# EAGLE design tb_target (EAGLE 6.2)
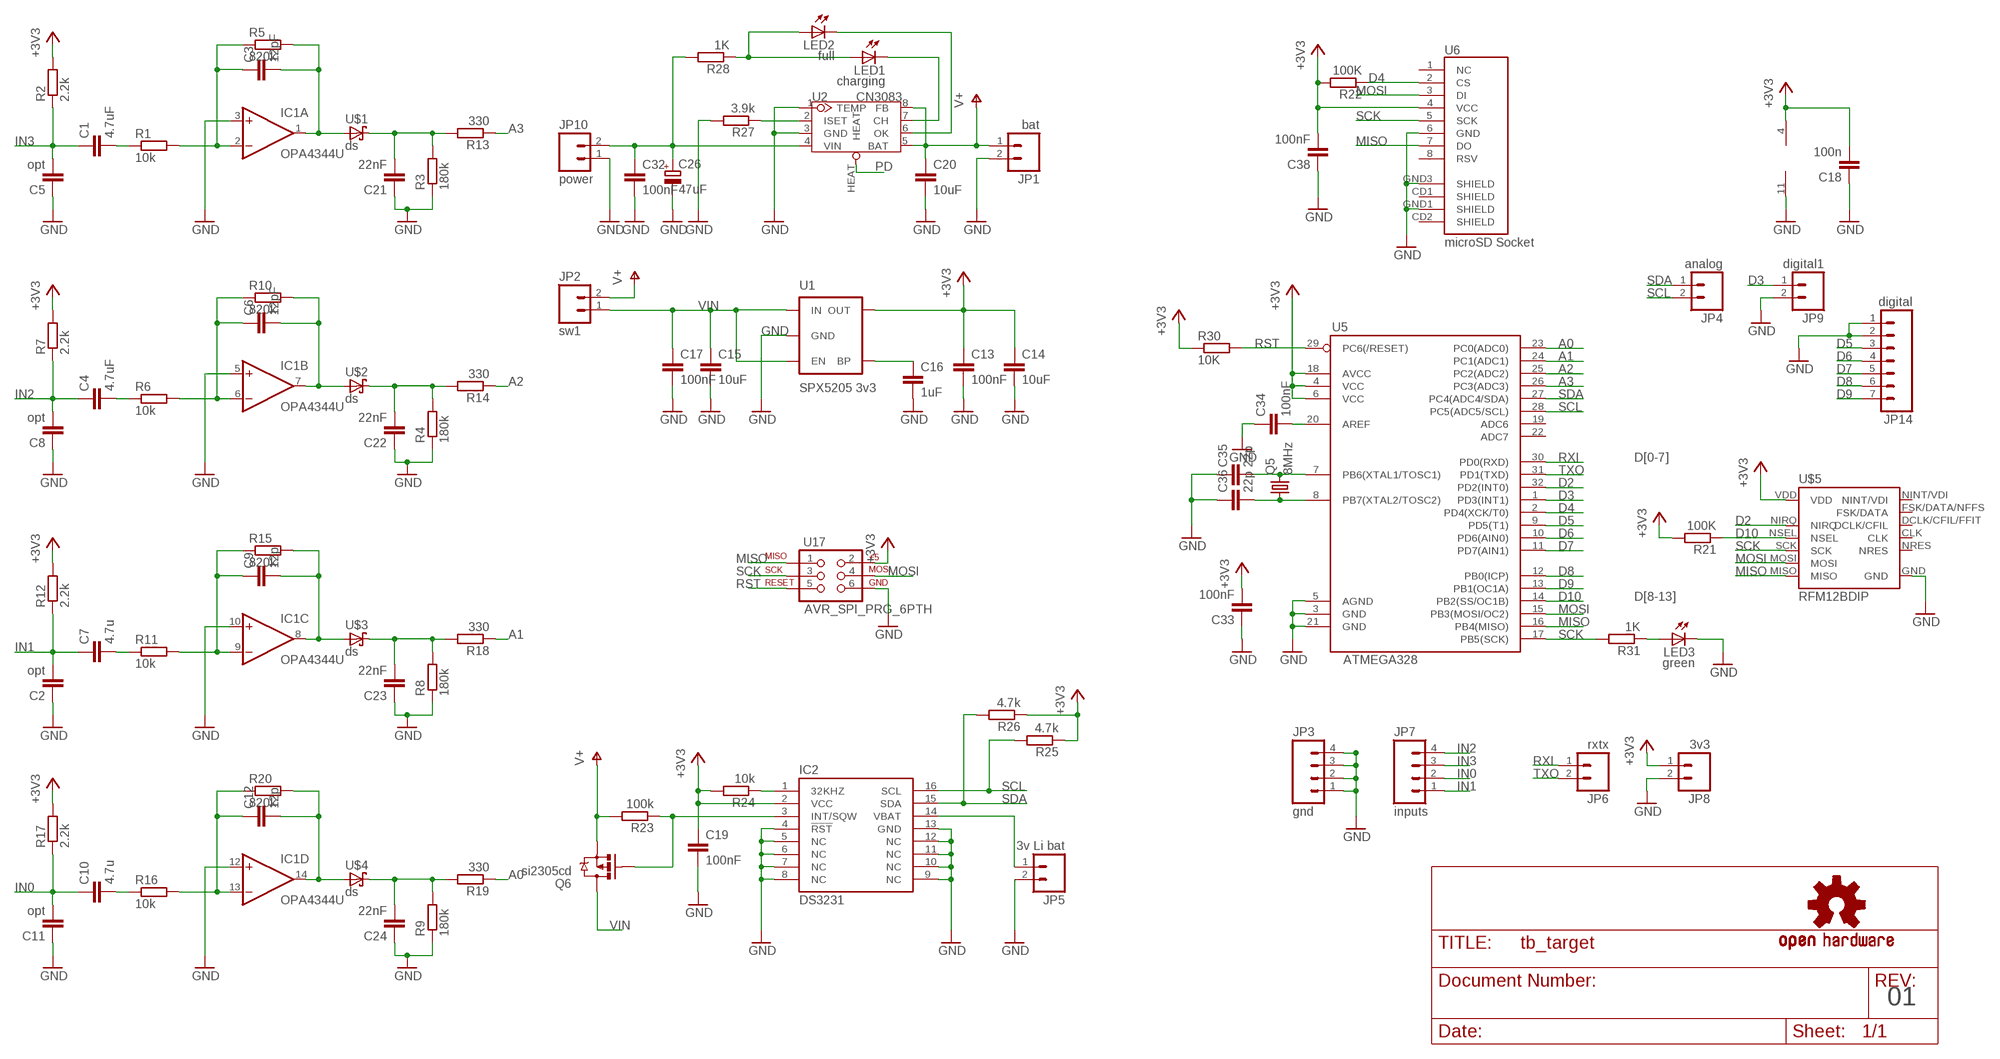
[diagram p0: schematic, sheet 1]

## Parts
C1  4.7uF  C-EUC0805  [C0805]
C2  opt  C-EUC0805  [C0805]
C3  12pF  C-EUC0805  [C0805]
C4  4.7uF  C-EUC0805  [C0805]
C5  opt  C-EUC0805  [C0805]
C6  12pF  C-EUC0805  [C0805]
C7  4.7u  C-EUC0805  [C0805]
C8  opt  C-EUC0805  [C0805]
C9  12p  C-EUC0805  [C0805]
C10  4.7u  C-EUC0805  [C0805]
C11  opt  C-EUC0805  [C0805]
C12  12p  C-EUC0805  [C0805]
C13  100nF  C-EUC0805  [C0805]
C14  10uF  C-EUC1206  [C1206]
C15  10uF  C-EUC1206  [C1206]
C16  1uF  C-EUC0805  [C0805]
C17  100nF  C-EUC0805  [C0805]
C18  100n  C-EUC0805  [C0805]
C19  100nF  C-EUC0805  [C0805]
C20  10uF  C-EUC1206  [C1206]
C21  22nF  C-EUC0805  [C0805]
C22  22nF  C-EUC0805  [C0805]
C23  22nF  C-EUC0805  [C0805]
C24  22nF  C-EUC0805  [C0805]
C26  47uF  CPOL-EUCT7343  [CT7343]
C32  100nF  C-EUC0805  [C0805]
C33  100nF  C-EUC0805  [C0805]
C34  100nF  C-EUC0805  [C0805]
C35  22p  C-EUC0805  [C0805]
C36  22p  C-EUC0805  [C0805]
C38  100nF  C-EUC0805  [C0805]
IC1  OPA4344U  [SO14]
IC2  DS3231  [SO-16]
JP1  bat  M02PTH  [1X02]
JP2  sw1  M02PTH  [1X02]
JP3  gnd  M04PTH  [1X04]
JP4  analog  M02PTH  [1X02]
JP5  3v Li bat  M02PTH  [1X02]
JP6  rxtx  M02PTH  [1X02]
JP7  inputs  M04PTH  [1X04]
JP8  3v3  M02PTH  [1X02]
JP9  digital1  M02PTH  [1X02]
JP10  power  M02PTH  [1X02]
JP14  digital  M07  [1X07]
LED1  charging  LEDCHIP-LED0805  [CHIP-LED0805]
LED2  full  LEDCHIP-LED0805  [CHIP-LED0805]
LED3  green  LEDCHIP-LED0805  [CHIP-LED0805]
Q5  8MHz  CRYTAL  [CRYSTAL_5X3.2]
Q6  si2305cd  MOSFET-PCHANNELSMD_POWER  [SOT23-3_POWER]
R1  10k  R-EU_R0805W  [R0805W]
R2  2.2k  R-EU_R0805W  [R0805W]
R3  180k  R-EU_R0805W  [R0805W]
R4  180k  R-EU_R0805W  [R0805W]
R5  820k  R-EU_R0805W  [R0805W]
R6  10k  R-EU_R0805W  [R0805W]
R7  2.2k  R-EU_R0805W  [R0805W]
R8  180k  R-EU_R0805W  [R0805W]
R9  180k  R-EU_R0805W  [R0805W]
R10  820k  R-EU_R0805W  [R0805W]
R11  10k  R-EU_R0805W  [R0805W]
R12  2.2k  R-EU_R0805W  [R0805W]
R13  330  R-EU_R0805W  [R0805W]
R14  330  R-EU_R0805W  [R0805W]
R15  820k  R-EU_R0805W  [R0805W]
R16  10k  R-EU_R0805W  [R0805W]
R17  2.2k  R-EU_R0805W  [R0805W]
R18  330  R-EU_R0805W  [R0805W]
R19  330  R-EU_R0805W  [R0805W]
R20  820k  R-EU_R0805W  [R0805W]
R21  100K  R-EU_R0805W  [R0805W]
R22  100K  R-EU_R0805W  [R0805W]
R23  100k  R-EU_R0805W  [R0805W]
R24  10k  R-EU_R0805W  [R0805W]
R25  4.7k  R-EU_R0805W  [R0805W]
R26  4.7k  R-EU_R0805W  [R0805W]
R27  3.9k  R-EU_R0805W  [R0805W]
R28  1K  R-EU_R0805W  [R0805W]
R30  10K  R-EU_R0805W  [R0805W]
R31  1K  R-EU_R0805W  [R0805W]
U1  SPX5205 3v3  V_REG_LDOSMD  [SOT23-5]
U2  CN3083  [SOP8-W/-HEAT]
U5  ATMEGA328  ATMEGA168  [TQFP32-08]
U6  microSD Socket  USD-SOCKETNEW  [MICRO-SD-SOCKET-PP]
U17  AVR_SPI_PRG_6PTH  [2X3]
U$1  ds  DIODE-SCHOTTKYMINIMELF  [SOD80]
U$2  ds  DIODE-SCHOTTKYMINIMELF  [SOD80]
U$3  ds  DIODE-SCHOTTKYMINIMELF  [SOD80]
U$4  ds  DIODE-SCHOTTKYMINIMELF  [SOD80]
U$5  RFM12BDIP  [RFM12B_DIP]
U$7  OSHW-LOGOM  [OSHW-LOGO-M]

## Nets
+3V3: C13.1 C14.1 C18.2 C19.1 C33.2 C38.2 IC1.4(P:V+) IC2.2(VCC) JP8.1 R2.2 R7.2 R12.2 R17.2 R21.2 R22.2 R24.2 R25.1 R26.1 R30.1 U1.5(OUT) U5.4(VCC) U5.6(VCC) U5.18(AVCC) U6.4(VCC) U17.2 U$5.VDD
A0: R19.1 U5.23(PC0(ADC0))
A0D: C24.2 R9.2 R19.2 U$4.C
A1: R18.1 U5.24(PC1(ADC1))
A1D: C23.2 R8.2 R18.2 U$3.C
A2: R14.1 U5.25(PC2(ADC2))
A2D: C22.2 R4.2 R14.2 U$2.C
A2E: C6.2 IC1.7(B:OUT) R10.2 U$2.A
A3: R13.1 U5.26(PC3(ADC3))
A3D: C21.2 R3.2 R13.2 U$1.C
D2: U5.32(PD2(INT0)) U$5.NIRQ
D3: JP9.1 U5.1(PD3(INT1))
D4: R22.1 U5.2(PD4(XCK/T0)) U6.2(CS)
D5: JP14.3 U5.9(PD5(T1))
D6: JP14.4 U5.10(PD6(AIN0))
D7: JP14.5 U5.11(PD7(AIN1))
D8: JP14.6 U5.12(PB0(ICP))
D9: JP14.7 U5.13(PB1(OC1A))
D10: R21.1 U5.14(PB2(SS/OC1B)) U$5.NSEL
GND: C2.1 C5.1 C8.1 C11.1 C13.2 C14.2 C15.2 C16.2 C17.2 C18.1 C19.2 C20.2 C21.1 C22.1 C23.1 C24.1 C26.- C32.2 C33.1 C34.1 C35.1 C36.1 C38.1 IC1.3(A:+IN) IC1.5(B:+IN) IC1.10(C:+IN) IC1.11(P:V-) IC1.12(D:+IN) IC2.4(!RST) IC2.5(NC) IC2.6(NC) IC2.7(NC) IC2.8(NC) IC2.9(NC) IC2.10(NC) IC2.11(NC) IC2.12(NC) IC2.13(GND) JP1.2 JP3.1 JP3.2 JP3.3 JP3.4 JP5.2 JP8.2 JP9.2 JP10.1 JP14.1 JP14.2 LED3.C R3.1 R4.1 R8.1 R9.1 R27.2 U1.2(GND) U2.1(TEMP) U2.3(GND) U5.3(GND) U5.5(AGND) U5.21(GND) U6.6(GND) U6.GND1(SHIELD) U6.GND3(SHIELD) U17.6 U$5.GND
IN0: C10.1 C11.2 JP7.2 R17.1
IN1: C2.2 C7.1 JP7.1 R12.1
IN2: C4.1 C8.2 JP7.4 R7.1
IN3: C1.1 C5.2 JP7.3 R2.1
MISO: U5.16(PB4(MISO)) U6.7(DO) U17.1 U$5.MISO
MOSI: U5.15(PB3(MOSI/OC2)) U6.3(DI) U17.4 U$5.MOSI
N$1: C16.1 U1.4(BP)
N$2: C1.2 R1.1
N$3: C3.1 IC1.2(A:-IN) R1.2 R5.1
N$4: IC2.1(32KHZ) R24.1
N$6: IC2.3(INT/SQW) Q6.1(G) R23.1
N$7: C4.2 R6.1
N$8: C6.1 IC1.6(B:-IN) R6.2 R10.1
N$10: IC2.14(VBAT) JP5.1
N$11: R27.1 U2.2(ISET)
N$12: C7.2 R11.1
N$13: C9.1 IC1.9(C:-IN) R11.2 R15.1
N$15: C26.+ C32.1 JP10.2 R28.2 U2.4(VIN)
N$16: LED1.A LED2.A R28.1
N$17: C10.2 R16.1
N$18: C12.1 IC1.13(D:-IN) R16.2 R20.1
N$20: LED1.C U2.7(CH)
N$21: LED2.C U2.6(OK)
N$26: C36.2 Q5.P$1 U5.8(PB7(XTAL2/TOSC2))
N$27: C35.2 Q5.P$2 U5.7(PB6(XTAL1/TOSC1))
N$28: C34.2 U5.20(AREF)
N$34: LED3.A R31.1
N$88: C3.2 IC1.1(A:OUT) R5.2 U$1.A
N$90: C9.2 IC1.8(C:OUT) R15.2 U$3.A
N$91: C12.2 IC1.14(D:OUT) R20.2 U$4.A
PD: U2.HEAT
RST: R30.2 U5.29(PC6(/RESET)) U17.5
RXI: JP6.1 U5.30(PD0(RXD))
SCK: R31.2 U5.17(PB5(SCK)) U6.5(SCK) U17.3 U$5.SCK
SCL: IC2.16(SCL) JP4.2 R25.2 U5.28(PC5(ADC5/SCL))
SDA: IC2.15(SDA) JP4.1 R26.2 U5.27(PC4(ADC4/SDA))
TXO: JP6.2 U5.31(PD1(TXD))
V+: C20.1 JP1.1 JP2.2 Q6.2(S) R23.2 U2.5(BAT) U2.8(FB)
VIN: C15.1 C17.1 JP2.1 Q6.3(D) U1.1(IN) U1.3(EN)
Unconnected: U5.19(ADC6) U5.22(ADC7) U6.1(NC) U6.8(RSV) U6.CD1(SHIELD) U6.CD2(SHIELD) U$5.CLK U$5.DCLK/CFIL/FFIT(DCLK/CFIL) U$5.FSK/DATA/NFFS(FSK/DATA) U$5.NINT/VDI U$5.NRES

## Notes on the sheet
- D[0-7]
- D[8-13]
- 01

## Library data of the parts
C1-C12 C18 C21-C24 = resistor:C-EU: CAPACITOR, European symbol
C13-C17 C19 C20 C32-C36 C38 = rcl:C-EU: CAPACITOR, European symbol
C26 = rcl:CPOL-EU: POLARIZED CAPACITOR, European symbol
IC1 = linear:OPA4*: Quad Operational Amplifier compatible with: TLC27L4 Low Power, Single-Supply, Rail-To-Rail Operational Amplifier Source: http://focus.ti.com/lit/ds/symlink/opa2345.pdf http://focus.ti.com .. opa241.pdf http://focus.ti.com .. tlc27l4.pdf http://focus.ti.com/lit/ds/symlink/opa2134.pdf
IC2 = ds3231:DS3231: DS3231 RTC
JP1 JP2 JP4-JP6 JP8-JP10 = SparkFun:M02: Header 2 Standard 2-pin 0.1" header. Use with straight break away headers (SKU : PRT-00116), right angle break away headers (PRT-00553), swiss pins (PRT-00743), machine pins (PRT-00117), and female headers (PRT-00115). Molex polarized connector foot print use with SKU : PRT-08233 with associated crimp pins and housings.
JP3 JP7 = SparkFun:M04: Header 4 Standard 4-pin 0.1" header. Use with straight break away headers (SKU : PRT-00116), right angle break away headers (PRT-00553), swiss pins (PRT-00743), machine pins (PRT-00117), and female headers (PRT-00115). Molex polarized connector foot print use with SKU : PRT-08231 with associated crimp pins and housings. 1MM SMD Version SKU: PRT-10208
JP14 = SparkFun-Connectors:M07: Header 7 Standard 7-pin 0.1" header. Use with straight break away headers (SKU : PRT-00116), right angle break away headers (PRT-00553), swiss pins (PRT-00743), machine pins (PRT-00117), and female headers (PRT-00115). NOTES ON THE VARIANTS LOCK and LOCK_LONGPADS... This footprint was designed to help hold the alignment of a through-hole component (i.e. 7-pin header) while soldering it into place. You may notice that each hole has been shifted either up or down by 0.005 of an inch from it's more standard position (which is usually a perfectly straight line). This slight alteration caused the pins (the squares in the middle) to touch the edges of the holes. Because they are alternating, it causes a "brace" to hold the header in place. 0.005 has proven to be the perfect amount of "off-center" position when using our standard breakaway headers. Although looks a little odd when you look at the bare footprint, once you have a header in there, the alteration is very hard to notice. Also, if you push a header all the way into place, it is covered up entirely on the bottom side. This idea of altering the position of holes to aid alignment will be further integrated into the Sparkfun Library for other footprints. It can help hold any component with 3 or more connection pins.
LED1-LED3 = led:LED: LED OSRAM: - CHIPLED LG R971, LG N971, LY N971, LG Q971, LY Q971, LO R971, LY R971 LH N974, LH R974 LS Q976, LO Q976, LY Q976 LO Q996 - Hyper CHIPLED LW Q18S LB Q993, LB Q99A, LB R99A - SideLED LS A670, LO A670, LY A670, LG A670, LP A670 LB A673, LV A673, LT A673, LW A673 LH A674 LY A675 LS A676, LA A676, LO A676, LY A676, LW A676 LS A679, LY A679, LG A679 - Hyper Micro SIDELED® LS Y876, LA Y876, LO Y876, LY Y876 LT Y87S - SmartLED LW L88C, LW L88S LB L89C, LB L89S, LG L890 LS L89K, LO L89K, LY L89K LS L896, LA L896, LO L896, LY L896 - TOPLED LS T670, LO T670, LY T670, LG T670, LP T670 LSG T670, LSP T670, LSY T670, LOP T670, LYG T670 LG T671, LOG T671, LSG T671 LB T673, LV T673, LT T673, LW T673 LH T674 LS T676, LA T676, LO T676, LY T676, LB T676, LH T676, LSB T676, LW T676 LB T67C, LV T67C, LT T67C, LS T67K, LO T67K, LY T67K, LW E67C LS E67B, LA E67B, LO E67B, LY E67B, LB E67C, LV E67C, LT E67C LW T67C LS T679, LY T679, LG T679 LS T770, LO T770, LY T770, LG T770, LP T770 LB T773, LV T773, LT T773, LW T773 LH T774 LS E675, LA E675, LY E675, LS T675 LS T776, LA T776, LO T776, LY T776, LB T776 LHGB T686 LT T68C, LB T68C - Hyper Mini TOPLED® LB M676 - Mini TOPLED Santana® LG M470 LS M47K, LO M47K, LY M47K Source: http://www.osram.convergy.de/
Q5 = Omat_komponentit:CRYTAL: CRYSTAL
Q6 = Simplex-DiscreteSemi:MOSFET-PCHANNEL: Generic PMOSFET
R1-R20 = resistor:R-EU_: RESISTOR, European symbol
R21-R28 R30 R31 = rcl:R-EU_: RESISTOR, European symbol
U1 = SparkFun:V_REG_LDO: Voltage Regulator LDO Standard 150mA LDO voltage regulator in SOT-23 layout. Micrel part MIC5205. BP (by-pass) pin is used to lower output noise with 470pF cap.
U2 = IC:CN3083
U5 = SparkFun:ATMEGA168
U6 = SparkFun:USD-SOCKET: microSD Socket Push-push type uSD socket. Schematic element and footprint production proven. Spark Fun Electronics SKU : PRT-00127. tDoc lines correctly indicate media card edge positions when inserting (unlocked, locked, depressed).
U17 = SparkFun:AVR_SPI_PRG_6: AVR ISP 6 Pin This is the reduced ISP connector for AVR programming. Common on Arduino. This footprint will take up less PCB space and can be used with a 10-pin to 6-pin adapter such as SKU: BOB-08508
U$1-U$4 = Simplex-DiscreteSemi:DIODE-SCHOTTKY: diode-schottky
U$5 = Simplex-ICs:RFM12B: RFM12B HopeRF FSK tranceiver
U$7 = SparkFun:OSHW-LOGO: Open Source Hardware Logo This logo indicates the piece of hardware it is found on incorporates a OSHW license and/or adheres to the definition of open source hardware found here: http://freedomdefined.org/OSHW

## Board
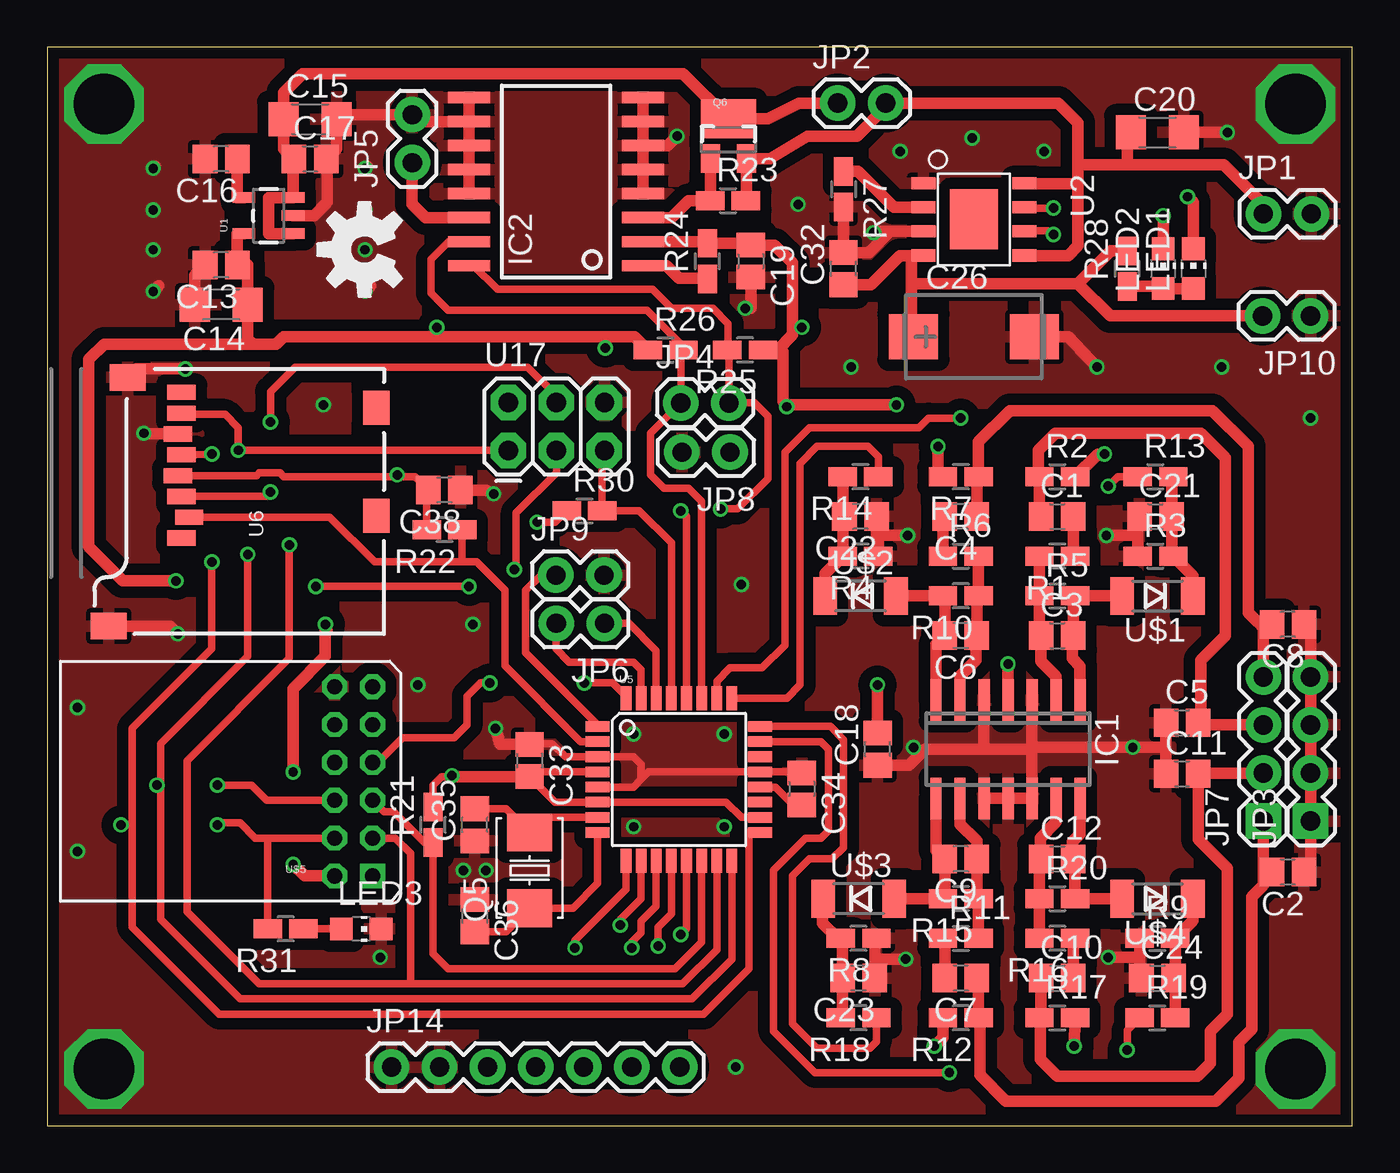
[diagram p1: board, top side]
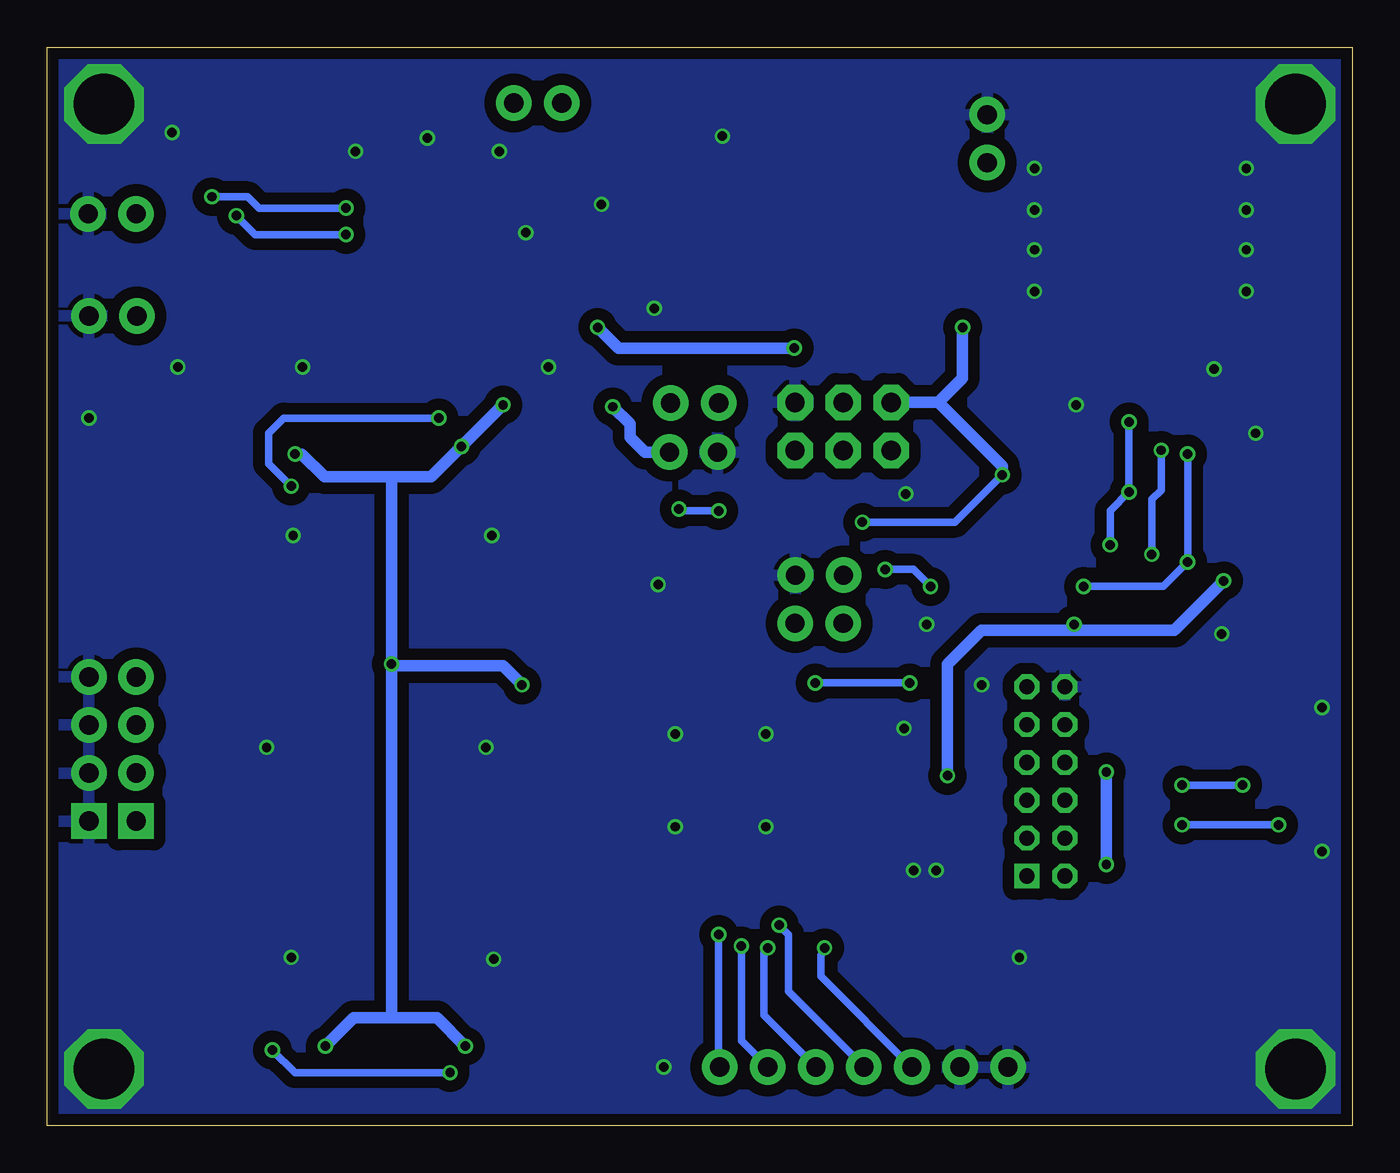
[diagram p2: board, bottom side, seen from below]

Size 69 x 57 mm. Coordinates in mm from the lower left corner, seen from the top.
Outline: 0,0 69,0 69,57 0,57 0,0
Copper layers (1*16): Top 0.035mm / dielectric 1.5mm / Bottom 0.035mm
Design rules: minimum track width 6mil, minimum drill 12mil, track to track 6mil, track to pad 6mil, pad to pad 6mil, via to via 6mil, smd to smd 0mil, copper to edge 10mil, drill to drill 10mil, minimum pad ring 10mil, minimum via ring 6mil, stop-mask expansion 2mil, vias tented up to drill 100mil, thermal gap 10mil

### Footprints (pad centres in the part's own frame; a part is rotated, then mirrored left to right if it is on the bottom)
C0805 = smd 1.3 x 1.5: 1 -0.85,0; 2 0.85,0
C1206 = smd 1.6 x 1.8: 1 -1.4,0; 2 1.4,0
CT7343 = smd 2.6 x 2.4: + -3.2,0; - 3.2,0
SO14 = smd 0.6 x 2.2: 1 -3.81,-2.6; 2 -2.54,-2.6; 3 -1.27,-2.6; 4 0,-2.6; 5 1.27,-2.6; 6 2.54,-2.6; 7 3.81,-2.6; 8 3.81,2.6; 9 2.54,2.6; 10 1.27,2.6; 11 0,2.6; 12 -1.27,2.6; 13 -2.54,2.6; 14 -3.81,2.6
SO-16 = smd 0.6 x 2.2: 1 -4.445,-4.6; 2 -3.175,-4.6; 3 -1.905,-4.6; 4 -0.635,-4.6; 5 0.635,-4.6; 6 1.905,-4.6; 7 3.175,-4.6; 8 4.445,-4.6; 9 4.445,4.6; 10 3.175,4.6; 11 1.905,4.6; 12 0.635,4.6; 13 -0.635,4.6; 14 -1.905,4.6; 15 -3.175,4.6; 16 -4.445,4.6
1X02 = drill 1.016 pad 1.88: 1 0,0; 2 2.54,0
1X04 = drill 1.016 pad 1.88 square: 1 0,0 | drill 1.016 pad 1.88: 2 2.54,0; 3 5.08,0; 4 7.62,0
1X07 = drill 1.016 pad 1.88: 1 0,0; 2 2.54,0; 3 5.08,0; 4 7.62,0; 5 10.16,0; 6 12.7,0; 7 15.24,0
CHIP-LED0805 = smd 1.2 x 1.2: A 0,-1.05; C 0,1.05
CRYSTAL_5X3.2 = smd 2 x 2.4: P$1 -2,0; P$2 2,0
SOT23-3_POWER = smd 1 x 1.5: 1 -0.939,-1.384; 2 0.961,-1.384 | smd 2.9 x 2.05: 3 0.011,0.716
R0805W = smd 1.5 x 1: 1 -0.94,0; 2 0.94,0
SOT23-5 = smd 0.55 x 1.2: 1 -0.95,-1.3; 2 0,-1.3; 3 0.95,-1.3; 4 0.95,1.3; 5 -0.95,1.3
SOP8-W/-HEAT = smd 0.635 x 1.27: 1 -1.905,-2.667; 2 -0.635,-2.667; 3 0.635,-2.667; 4 1.905,-2.667; 5 1.905,2.667; 6 0.635,2.667; 7 -0.635,2.667; 8 -1.905,2.667 | smd 3.175 x 2.54: HEAT 0,0
TQFP32-08 = smd 1.27 x 0.559: 1 -4.293,2.8; 2 -4.293,2; 3 -4.293,1.2; 4 -4.293,0.4; 5 -4.293,-0.4; 6 -4.293,-1.2; 7 -4.293,-2; 8 -4.293,-2.8; 17 4.293,-2.8; 18 4.293,-2; 19 4.293,-1.2; 20 4.293,-0.4; 21 4.293,0.4; 22 4.293,1.2; 23 4.293,2; 24 4.293,2.8 | smd 0.559 x 1.27: 9 -2.8,-4.293; 10 -2,-4.293; 11 -1.2,-4.293; 12 -0.4,-4.293; 13 0.4,-4.293; 14 1.2,-4.293; 15 2,-4.293; 16 2.8,-4.293; 25 2.8,4.293; 26 2,4.293; 27 1.2,4.293; 28 0.4,4.293; 29 -0.4,4.293; 30 -1.2,4.293; 31 -2,4.293; 32 -2.8,4.293
MICRO-SD-SOCKET-PP = smd 0.8 x 1.5: 1 -8.94,10.7; 2 -7.84,10.3; 3 -6.74,10.7; 4 -5.64,10.9; 5 -4.54,10.7; 6 -3.44,10.9; 7 -2.34,10.7; 8 -1.24,10.7 | smd 1.8 x 1.4: CD1 -2.05,0.4; CD2 -7.75,0.4 | smd 1.4 x 1.9: GND1 -13.6,14.55; GND3 -0.45,13.55
2X3 = drill 1.016 pad 1.88 octagon: 1 0,0; 2 0,2.54; 3 2.54,0; 4 2.54,2.54; 5 5.08,0; 6 5.08,2.54
SOD80 = smd 1.25 x 2: A 1.875,0; C -1.875,0
RFM12B_DIP = drill 0.8 octagon: CLK 1,-3; DCLK/CFIL/FFIT -1,-3; FSK/DATA/NFFS 1,-1; GND 1,-5; MISO 1,1; MOSI -1,3; NIRQ -1,-1; NRES -1,-5; NSEL -1,1; SCK 1,3; VDD 1,5 | drill 0.8 square: NINT/VDI -1,5

### Placement (x,y rotation side)
C1  53.4,32.2 0 top
C2  65.6,13.4 180 top
C3  53.4,25.9 0 top
C4  48.3,32.2 180 top
C5  60,21.3 0 top
C6  48.3,25.9 180 top
C7  48.3,7.8 180 top
C8  65.6,26.5 180 top
C9  48.3,14.1 180 top
C10  53.4,7.8 0 top
C11  60,18.6 0 top
C12  53.4,14.1 0 top
C13  9.2,45.5 180 top
C14  9.2,43.4 180 top
C15  13.9,53.2 0 top
C16  9.2,51.1 180 top
C17  13.9,51.1 0 top
C18  43.9,19.9 90 top
C19  37.2,45.7 270 top
C20  58.7,52.5 0 top
C21  58.6,32.2 0 top
C22  43,32.2 180 top
C23  42.9,7.8 180 top
C24  58.7,7.8 0 top
C26  49,41.7 0 top
C32  42.1,45.3 90 top
C33  25.5,19.3 270 top
C34  39.9,17.8 270 top
C35  22.6,15.9 90 top
C36  22.6,11.1 270 top
C38  21,33.6 180 top
IC1  50.8,19.9 180 top
IC2  26.9,49.9 90 top
JP1  64.3,48.2 0 top
JP2  41.79,54.05 0 top
JP3  66.8,16.1 90 top
JP4  33.5,38.2 0 top
JP5  19.3,50.9 90 top
JP6  29.46,26.55 180 top
JP7  64.3,16.1 90 top
JP8  36.1,35.6 180 top
JP9  26.9,29.1 0 top
JP10  66.8,42.8 180 top
JP14  18.2,3.1 0 top
LED1  60.6,45.3 0 top
LED2  59,45.3 0 top
LED3  16.6,10.4 270 top
Q5  25.5,13.5 90 top
Q6  36,52.5 0 top
R1  53.4,30.1 180 top
R2  53.4,34.3 0 top
R3  58.6,30.1 0 top
R4  43,30.1 180 top
R5  53.4,28 0 top
R6  48.3,30.1 0 top
R7  48.3,34.3 180 top
R8  42.9,9.9 180 top
R9  58.7,9.9 0 top
R10  48.3,28 180 top
R11  48.3,9.9 0 top
R12  48.3,5.7 180 top
R13  58.6,34.3 0 top
R14  43,34.3 180 top
R15  48.3,12 180 top
R16  53.4,9.9 180 top
R17  53.4,5.7 0 top
R18  42.9,5.7 180 top
R19  58.7,5.7 0 top
R20  53.4,12 0 top
R21  20.4,15.9 90 top
R22  21,31.5 180 top
R23  36,48.9 0 top
R24  34.9,45.7 90 top
R25  36.9,41 180 top
R26  32.7,41 0 top
R27  42.1,49.5 270 top
R28  57.1,45.3 90 top
R30  28.4,32.5 0 top
R31  12.6,10.4 180 top
U1  11.7,48.1 90 top
U2  49,47.9 270 top
U5  33.4,18.3 0 top
U6  17.8,40 90 top
U17  24.38,35.69 0 top
U$1  58.7,28 180 top
U$2  43,28 0 top
U$3  42.9,12 0 top
U$4  58.7,12 180 top
U$5  16.2,18.2 180 top
U$7  16.77,46.31 90 top

### Tracks (layer width: path | path; a pad name or v marks a point on that pad's centre or on a via)
+3V3  (via drill 0.5)
  Top 0.406: C33.2 26.85,17.1 U5.6 35.9,17.1 36.7,16.3 U5.18 | U5.4 25.75,18.7 C33.2 | C33.2 22.65,18.45 | R22.2 20.06,33.51 C38.2 19.45,34.3 18.6,34.3 | U6.4 11.06,34.36 11.2,34.5 12.3,34.5 12.5,34.3 18.6,34.3 | v18.5,34.4 18.6,34.3 | v25.9,31.9 26.86,31.9 R30.1 | 21.45,18.45 20.85,18.45 20.4,18 R21.2
  Top 0.61: R2.2 55.54,35.5 v55.9,35.5 | R7.2 47.1,34.56 v47.1,35.9 | IC1.4 v50.8,24.4 | C18.2 v43.9,23.3 | R12.2 47.36,4.66 v46.9,4.2 | R17.2 54.34,5.66 v54.3,4.2 | IC2.2 34.81,46.73 R24.2 37.11,46.64 C19.1 38.45,46.55 39.4,45.6 39.4,42.3 | U1.5 10.05,47.15 C13.1 10.6,45.5 C14.1 10.6,41.6 10.9,41.3 | 39.4,42.3 39.4,41.8 38.6,41 | 38.6,41 R25.1 | 38.6,41 38.9,40.9 38.9,38.3 v39.1,38 39.2,38.1 v44.9,38.1 | 20.6,41.7 29.5,41.7 | 29.5,41.7 31.06,41.7 R26.1 | v29.5,41.1 29.5,41.7 | v39.9,42.2 39.5,42.2 39.4,42.3 | v20.6,42.2 20.6,41.7 | v6.8,28.8 4,28.8 2.2,30.6 2.2,40.5 3,41.3 10.9,41.3 | 10.9,41.3 12.1,41.3 12.5,41.7 20.6,41.7 | v21.4,18.5 21.45,18.45 C33.2 | U$5.VDD 13.6,13.2 v13,13.8 | v13,18.7 13,23.1 14.7,24.8 14.7,26.2 | 14.7,26.2 14.8,26.2 | v14.7,26.5 14.7,26.2
  Bottom 0.406: v25.9,31.9 21,31.9 v18.5,34.4
  Bottom 0.61: 50.8,34.3 48.7,34.3 v47.1,35.9 v44.9,38.1 | 50.8,34.3 R2.2 55.54,35.5 v55.9,35.5 | v43.9,23.3 44.9,24.3 50.7,24.3 v50.8,24.4 | v50.8,24.4 50.8,34.3 | v46.9,4.2 48.4,5.7 50.8,5.7 | v50.8,24.4 50.8,5.7 | JP8.1 37.4,35.6 38.2,36.4 38.2,37.1 v39.1,38 | 50.8,5.7 52.8,5.7 v54.3,4.2 | v29.5,41.1 38.8,41.1 v39.9,42.2 | U17.2 21.87,38.23 | 21.87,38.23 20.6,39.5 v20.6,42.2 | v21.4,18.5 21.4,24.4 19.6,26.2 14.7,26.2 | 14.7,26.2 9.4,26.2 v6.8,28.8 | v13,13.8 v13,18.7 | v14.7,26.5 14.7,26.2 | 21.87,38.23 18.5,34.86 v18.5,34.4
A0  (via drill 0.5)
  Top 0.406: v57.1,4 57.1,5.04 R19.1 | v47.7,2.8 40.6,2.8 38.4,5 38.4,13.5 40.1,15.2 40.9,15.2 41.3,15.6 41.3,19.9 40.9,20.3 U5.23
  Bottom 0.406: v57.1,4 55.9,2.8 v47.7,2.8
A0D
  Top 0.61: R19.2 59.64,7.71 C24.2 59.64,7.89 R9.2 60.58,10.84 U$4.C
A1
  Top 0.406: R18.1 43.84,4.44 43.5,4.1 40.7,4.1 39.4,5.4 39.4,13.2 40.3,14.1 41.5,14.1 42.1,14.7 42.1,20.4 41.4,21.1 U5.24
A1D
  Top 0.61: U$3.C 41,11.97 41,10.7 41.8,9.9 R8.2 42.05,9.81 C23.2 42.05,5.79 R18.2
A2
  Top 0.406: R14.1 43.94,35.36 43.4,35.9 40.7,35.9 39.8,35 39.8,23.3 39.1,22.6 U5.25
A2D
  Top 0.61: U$2.C 41.12,29.16 R4.2 42.06,32.11 C22.2 42.06,32.29 R14.2
A2E
  Top 0.61: U$2.A R10.2 47.45,27.91 C6.2 46.99,25.44 IC1.7
A3  (via drill 0.5)
  Top 0.406: U5.26 35.4,23.5 36.1,24.2 37.8,24.2 39,25.4 39,35.6 40.3,36.9 46.1,36.9 46.6,37.4 v48.3,37.4 | R13.1 56.6,34.3 v56.1,33.8
  Bottom 0.406: v56.1,33.8 57.3,35 57.3,36.6 56.5,37.4 v48.3,37.4
A3D
  Top 0.61: R13.2 59.45,34.21 C21.2 59.45,30.19 R3.2 60.58,29.07 U$1.C
D2  (via drill 0.5)
  Top 0.406: U5.32 30.6,22.7 29.9,23.4 v28.4,23.4 | U$5.NIRQ 17.5,19.2 18.8,20.5 21.5,20.5 22.2,21.2 22.2,22.7 22.9,23.4 v23.4,23.4
  Bottom 0.406: v28.4,23.4 v23.4,23.4
D3
  Top 0.406: U5.1 29.11,21.19 25.3,25 25.3,28.3 26.1,29.1 JP9.1
D4
  Top 0.406: U5.2 28.2,20.3 24.2,24.3 24.2,28.3 22.7,29.8 22,29.8 | U6.2 14.94,32.16 17.3,29.8 22,29.8 | R22.1 21.94,29.86 22,29.8
D5  (via drill 0.5)
  Top 0.406: U5.9 30.6,12.5 27.9,9.8 v27.9,9.4
  Bottom 0.406: v27.9,9.4 28.1,9 28.1,7.9 23.3,3.1 JP14.3
D6  (via drill 0.5)
  Top 0.406: U5.10 31.4,12 30.3,10.9 v30.3,10.6
  Bottom 0.406: v30.3,10.6 29.8,10.1 29.8,7.1 25.82,3.12 JP14.4
D7  (via drill 0.5)
  Top 0.406: U5.11 32.2,11.6 31.4,10.8 31.4,10.2 30.9,9.7 v30.9,9.4
  Bottom 0.406: JP14.5 31.1,5.84 31.1,9.2 v30.9,9.4
D8  (via drill 0.5)
  Top 0.406: U5.12 33,11.2 32.3,10.5 v32.3,9.5
  Bottom 0.406: v32.3,9.5 32.3,4.5 JP14.6
D9  (via drill 0.5)
  Top 0.406: U5.13 33.8,10.4 v33.5,10.1
  Bottom 0.406: v33.5,10.1 33.5,3.16 JP14.7
D10
  Top 0.406: U5.14 34.6,9.7 33.2,8.3 21.2,8.3 20.4,9.1 R21.1 19.94,14.96 18.3,16.6 17.8,16.6 U$5.NSEL
GND  (via drill 0.5, 3.2)
  Top 0.406: C34.1 39.85,18.7 U5.21 31.8,18.7 31.4,18.3 | U5.5 31,17.9 31.4,18.3 | 31.4,18.3 31.4,19.1 31,19.5 U5.3 27.4,19.5 26.7,20.2 25.55,20.2 C33.1 | LED3.C 18,10.25
  Top 0.61: C21.1 57.66,32.11 R3.1 57.66,31.2 v56,31.2 | R4.1 43.94,32.11 C22.1 43.85,31.2 v45.5,31.2 | C24.1 57.76,7.89 57.76,8.9 | 57.76,8.9 R9.1 | C23.1 43.75,8.7 | 43.75,8.7 43.75,9.81 R8.1 | C11.1 C5.1 59.15,20 v57.4,20 52.07,20 | IC1.10 IC1.11 IC1.12 52.07,19.9 | IC1.3 52.07,20 | IC1.5 49.53,19.9 | 49.53,19.9 52.07,19.9 | 52.07,19.9 52.07,20 | C18.1 45.55,19.05 46.4,19.9 49.53,19.9 | v45.4,8.8 43.85,8.8 43.75,8.7 | v56.1,8.9 57.76,8.9 | C2.1 66.8,13.75 JP3.1 JP3.2 JP3.3 JP3.4 66.8,26.15 arc90 C8.1 | U2.1 46.2,49.8 | R27.2 C32.2 43.45,46.15 44.56,47.27 U2.3 44.03,47.27 v43.7,47.2 | IC2.4 IC2.5 IC2.6 | IC2.6 IC2.7 IC2.8 | IC2.13 IC2.12 IC2.11 IC2.10 | IC2.10 IC2.9 | IC2.10 19.3,53.08 JP5.2 15.54,53.44 C15.2 15.3,51.65 C17.2 14.8,51.05 14.8,48.8 14.1,48.1 U1.2 | C26.- 54,41.7 v55.5,40.1 | v23.7,21 23.95,20.15 C33.1 | U6.GND1 6.5,26.4 v6.9,26 | U6.GND3 4.7,40 v7.3,40 | v5.6,50.6 5.7,50.7 | v36.9,43.2 37.2,43.2 C19.2 | U6.6 5.14,36.56 v5.1,36.6 | C14.2 7.8,44.95 C13.2 | v33.3,52.3 32.8,51.8 IC2.6 | C20.2 v62.4,52.5 | 5.9,44.4 v5.6,44.1 | C38.1 23.2,33.6 v23.6,33.4 | v16.8,50.6 16.9,50.7 | 17.1,44.4 v16.8,44.1
  other vias: 66,3 3,3 3,54 66,54 45.1,51.5 5.6,48.4 5.6,46.3 45.8,20 17.6,8.9 36.4,3.1 31,20.7 35.8,20.7 31,15.8 35.8,15.8 22,13.5 23.2,13.5 16.8,48.4 16.8,46.3 1.6,22.1 1.6,14.5 36.7,28.6 22.5,26.5 19.6,23.3 14.6,38.1 66.8,37.4 62.1,40.1 39.7,48.7 48.9,52.2 52.7,51.5 42.5,40.1
  pour Bottom (isolate 0.61): 0.2,56.8 68.8,56.8 68.8,0.2 0.2,0.2
  pour Top (isolate 0.61): 0.2,56.8 0.2,0.2 68.8,0.2 68.8,56.8
IN0
  Top 0.61: C10.1 52.55,5.79 R17.1 52.5,5.66 52.5,3.5 53.4,2.6 60.8,2.6 61.5,3.3 61.5,5 62.4,5.9 62.4,13.6 60.85,15.15 C11.2 60.85,18.64 JP7.2
IN1
  Top 0.61: C7.1 49.24,7.8 R12.1 49.3,5.64 49.3,2.7 50.7,1.3 61.8,1.3 63,2.5 63,4.4 63.7,5.1 63.7,12.1 64.3,12.7 64.3,12.95 | JP7.1 64.3,12.95 | 64.3,12.95 C2.2
IN2
  Top 0.61: C4.1 49.15,34.21 R7.1 49.24,36.14 50.9,37.8 61.6,37.8 63.5,35.9 63.5,27.1 64,26.6 | 64,26.6 64.65,26.6 C8.2 | JP7.4 64.3,26.3 64,26.6
IN3
  Top 0.61: C1.1 52.46,32.2 R2.1 52.4,34.36 52.4,35.7 53.3,36.6 61,36.6 62.3,35.3 62.3,25.9 61,24.6 61,21.45 C5.2 60.85,21.18 JP7.3
MISO  (via drill 0.5)
  Top 0.406: U5.16 36.2,8.8 34.1,6.7 10.2,6.7 6,10.9 6,18 | 7.06,37.7 U6.7 7.16,37.6 9.4,37.6 10.1,36.9 v10.1,35.7 v10.11,35.69 U17.1 | v10.6,30.2 10.6,24.8 6,20.2 6,18 | v5.8,18 6,18 | v9,18 10.8,18 11.6,17.2 U$5.MISO
  Bottom 0.406: v5.8,18 v9,18 | v10.6,30.2 10.6,33.1 10.1,33.6 v10.1,35.7
MOSI  (via drill 0.5)
  Top 0.406: U5.15 35.4,9.3 33.6,7.5 19.2,7.5 | 19.2,7.5 11.2,7.5 7.4,11.3 7.4,19.3 12.8,24.7 v12.8,30.7 | U$5.MOSI 18.4,15.2 19.2,14.4 19.2,7.5 | v11.8,33.5 11.56,33.26 U6.3 | U17.4 26.92,38.58 25.4,40.1 13.1,40.1 11.8,38.8 v11.8,37.2
  Bottom 0.406: v12.8,30.7 12.8,32.5 v11.8,33.5 v11.8,37.2
N$1
  Top 0.61: C16.1 10.05,49.05 U1.4
N$2
  Top 0.61: R1.1 54.25,30.1 C1.2
N$3
  Top 0.61: R1.2 R5.1 52.46,25.9 C3.1 | C3.1 | IC1.2 53.34,23.76 52.55,24.55 C3.1
N$4
  Top 0.61: IC2.1 32.74,45.45 33.4,44.8 34.86,44.8 R24.1
N$6
  Top 0.61: R23.1 Q6.1 | R23.1 34.95,48.8 | IC2.3 32.99,47.99 33.9,48.9 R23.1
N$7
  Top 0.61: R6.1 47.36,32.11 C4.2
N$8
  Top 0.61: R6.2 R10.1 49.15,27.91 C6.1 49.1,25.85 49.1,24.6 48.26,23.76 IC1.6
N$10
  Top 0.61: IC2.14 20,47.99 19.3,48.7 JP5.1
N$11
  Top 0.61: U2.2 44.77,48.53 42.86,50.44 R27.1
N$12
  Top 0.61: C7.2 47.45,9.9 R11.1
N$13
  Top 0.61: R11.2 R15.1 49.15,12.09 C9.1 49.15,15.05 48.26,15.94 IC1.9
N$15
  Top 0.61: U2.4 45.6,45.99 | 45.6,45.99 45.09,45.99 43.55,44.45 C32.1 | 56.84,46.5 R28.2 56.24,46.24 54.5,44.5 | 45.7,44.5 45.7,41.8 C26.+ | JP10.2 56.2,42.8 54.5,44.5 | 54.5,44.5 45.7,44.5 | 45.7,44.5 45.7,45.9 45.6,45.99
N$16
  Top 0.61: R28.1 58.89,44.36 LED2.A LED1.A
N$17
  Top 0.61: C10.2 54.25,9.81 R16.1
N$18
  Top 0.61: R16.2 R20.1 52.46,14.01 C12.1 52.5,14.15 52.5,15.2 53.34,16.04 IC1.13
N$20  (via drill 0.5)
  Top 0.406: v53.2,48.5 53,48.6 52.9,48.5 51.7,48.5 U2.7
  Top 0.61: v60.3,49.1 60.6,48.8 LED1.C
  Bottom 0.406: v53.2,48.5 57.8,48.5 58.4,49.1 v60.3,49.1
N$21  (via drill 0.5)
  Top 0.406: v53.2,47.1 53,47.2 52.9,47.3 51.7,47.3 U2.6
  Top 0.61: LED2.C v59,48.1
  Bottom 0.406: v53.2,47.1 58,47.1 v59,48.1
N$26
  Top 0.406: U5.8 29.11,12.81 27.8,11.5 Q5.P$1 24.25,10.25 C36.2
N$27
  Top 0.406: U5.7 26.3,16.3 Q5.P$2 24.25,16.75 C35.2
N$28
  Top 0.406: U5.20 38.5,17.9 39.45,16.95 C34.2
N$34
  Top 0.406: R31.1 LED3.A
N$88
  Top 0.61: U$1.A R5.2 54.25,27.91 C3.2 | 54.3,25.85 C3.2 | IC1.1 54.61,24.29 54.2,24.7 54.2,25.85 C3.2
N$90
  Top 0.61: U$3.A R15.2 47.45,12.09 C9.2 46.99,14.56 IC1.8
N$91
  Top 0.61: IC1.14 54.61,15.41 54.2,15 54.2,14.15 C12.2 54.34,14.01 R20.2 U$4.A
RST
  Top 0.406: U5.29 33,30.8 31.3,32.5 R30.2 29.34,35.37 U17.5
RXI
  Top 0.406: U5.30 32.2,25.1 30.75,26.55 JP6.1
SCK  (via drill 0.5)
  Top 0.406: U5.17 37.1,15.5 37.1,8.3 34.7,5.9 9.1,5.9 4.5,10.5 4.5,15.9 | 11.6,15.2 11,15.2 10.2,16 9.1,16 arc90 v9,15.9 | 11.6,15.2 U$5.SCK | 4.5,15.9 v3.9,15.9 | 4.5,15.9 4.5,21 8.7,25.2 v8.7,29.8 | v8.7,35.5 7.84,35.46 U6.5 | U17.3 26.92,34.52 24.8,32.4 24.8,29.5 v24.7,29.4 | v22.3,28.5 v14.2,28.5 | R31.2 11.66,15.14 11.6,15.2
  Bottom 0.406: v3.9,15.9 v9,15.9 | v8.7,35.5 v8.7,29.8 10,28.5 v14.2,28.5 | v22.3,28.5 23.2,29.4 v24.7,29.4
SCL  (via drill 0.5)
  Top 0.406: IC2.16 22.55,45.45 23.8,44.2 32,44.2 33,43.2 35.2,43.2 36,42.4 36,41.04 R25.2 36.04,40.92 JP4.2 37.4,38.2 38.1,37.5 38.1,34.2 36.5,32.6 v35.6,32.6 | U5.28 33.8,32.2 v33.5,32.5
  Bottom 0.406: v33.5,32.5 35.5,32.5 v35.6,32.6
SDA
  Top 0.406: IC2.15 21.23,46.73 20.3,45.8 20.3,44 21.2,43.1 31.7,43.1 33.64,41.16 R26.2 33.5,40.86 JP4.1 31.9,36.6 31.9,34.4 32.6,33.7 33.9,33.7 34.6,33 U5.27
TXO
  Top 0.406: U5.31 31.4,24.1 31,24.5 27.6,24.5 26.9,25.2 26.9,26.53 JP6.2 27.1,26.53
V+
  Top 0.61: U2.5 53.99,45.99 54.5,46.5 54.5,49.8 | 54.5,49.8 U2.8 | 54.5,50.8 57.1,50.8 | 57.1,50.8 62.2,50.8 64.24,48.76 JP1.1 64.1,48.11 | 54.5,49.8 54.5,50.8 | C20.1 57.1,52.5 57.1,50.8 | 54.5,50.8 54.5,53 53.45,54.05 JP2.2 44.33,53.83 42.8,52.3 40.2,52.3 38.22,51.12 Q6.2 36.96,48.92 R23.2
VIN
  Top 0.61: JP2.1 39.75,54.05 38.12,53.22 Q6.3 33.63,55.6 13.5,55.6 12.5,54.6 C15.1 12.5,51.65 C17.1 13,51.1 U1.3 11.7,49.05 11.7,47.15 U1.1

### Text on the board
tMine: sw | gnd | power | tb_target rev1 | petre rodan | 2012 08 | 3v | 3.7v | acu | gnd | full | chg | 5v | gnd | sda | scl | icsp | a2 | . | gnd | 3v3 | a3 | gnd | a0 | d3 | gnd | a1 | txo | rxi | sclk | gnd | gnd | d5 | d6 | d7 | d8 | d9